# Altium schematic sheet BLOCK Diagram.SchDoc
size A; SheetNumber: 1; SheetTotal: 6
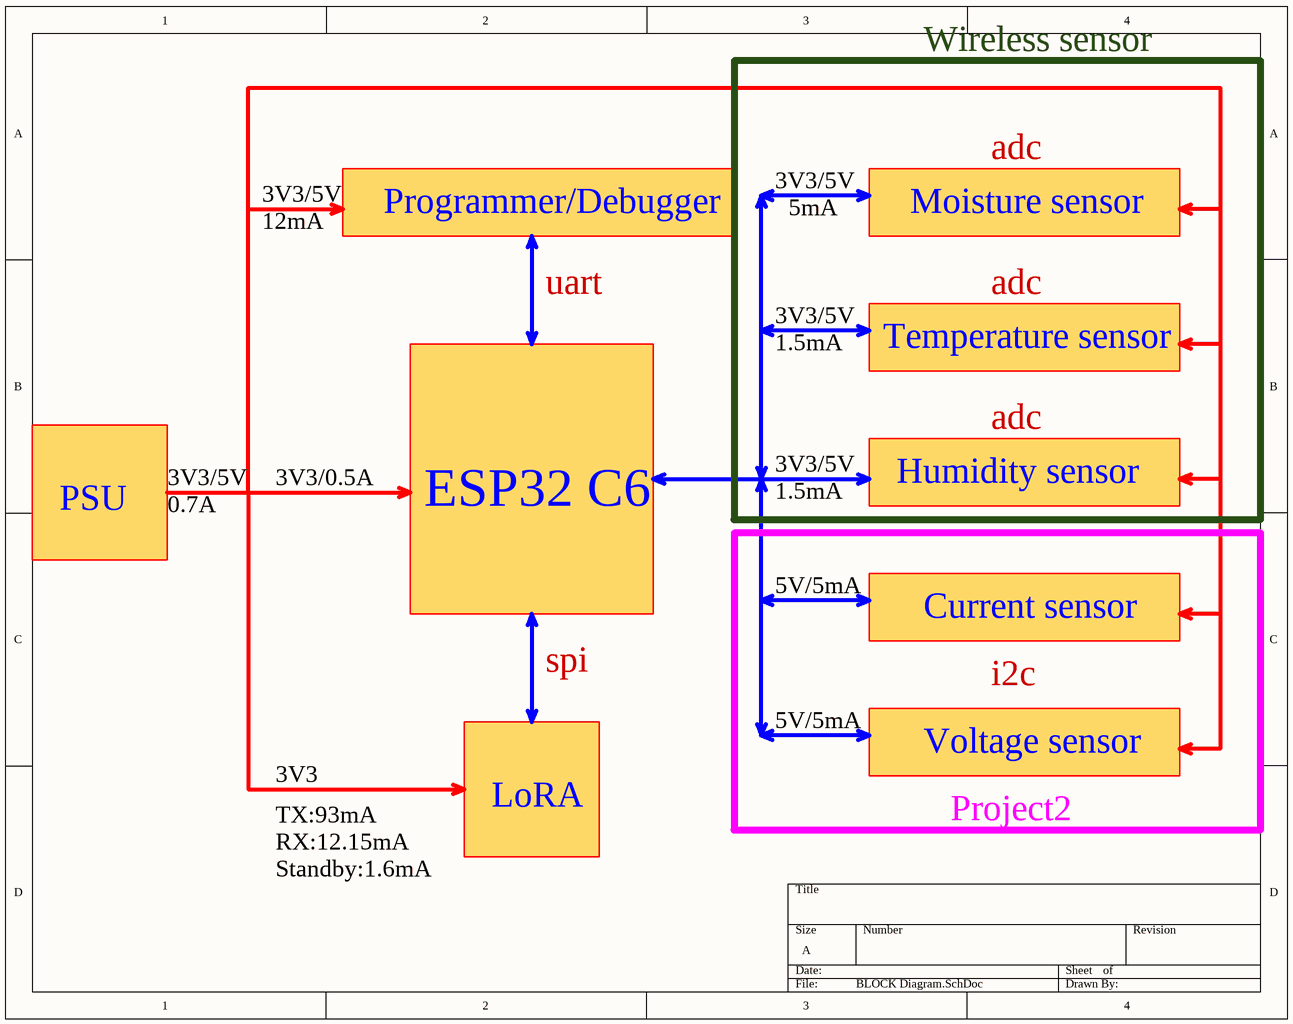
[diagram p0: BLOCK Diagram.SchDoc]

## Notes on the sheet
- Wireless sensor
- adc
- 3V3/5V
- 12mA
- Programmer/Debugger
- 5mA
- Moisture sensor
- uart
- 1.5mA
- Temperature sensor
- 3V3/0.5A
- Humidity sensor
- PSU
- 0.7A
- ESP32 C6
- 5V/5mA
- Current sensor
- spi
- i2c
- Voltage sensor
- 3V3
- TX:93mA
- LoRA
- Project2
- RX:12.15mA
- Standby:1.6mA